# EasyEDA Pro project ProProject_Driver_STM32F031_2023-10-07.epro, schematic Schematic1_3
Create Date: 2023-06-01; Page Name: P1; Project Name: Board1_2; Schematic Name: Schematic1_2; Update Date: 2023-06-05; Company: 嘉立创EDA; Page Size: A4; Version: V1.0
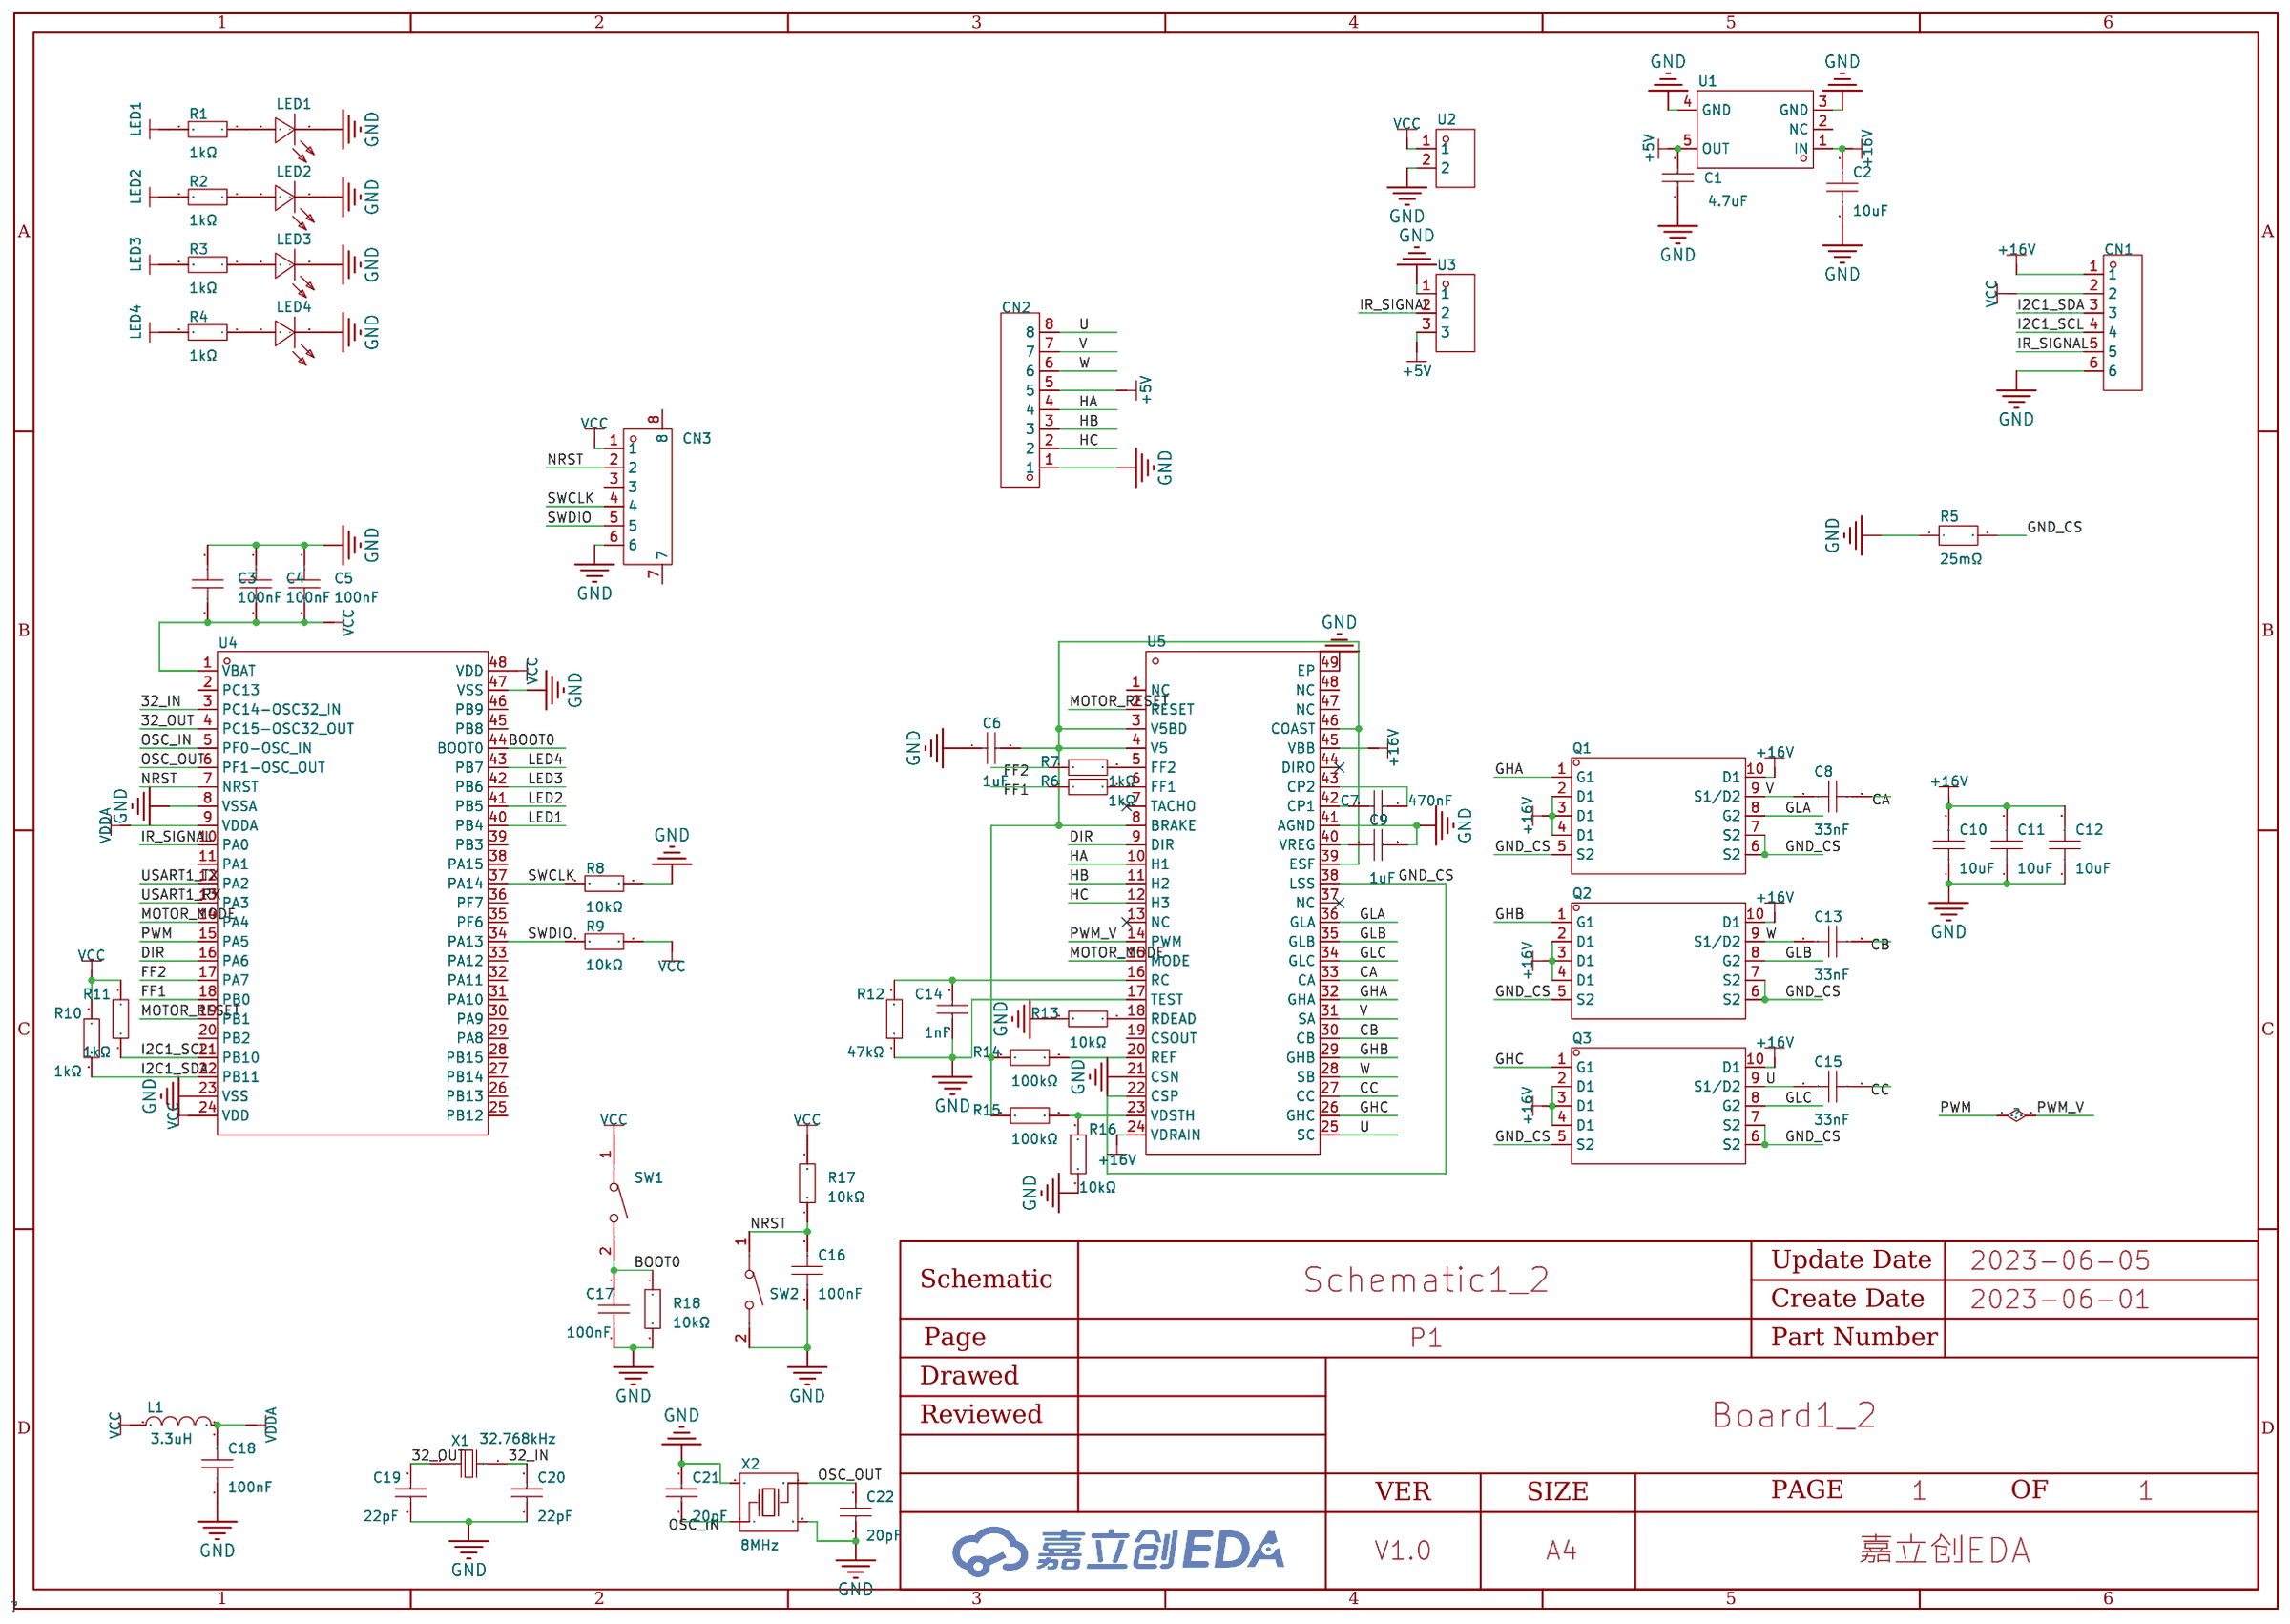
[diagram p1: schematic sheet]

## Parts
C1  4.7uF  [C0603]
C2  10uF  [C0603]
C3  100nF  [C0603]
C4  100nF  [C0603]
C5  100nF  [C0603]
C6  1uF  [C0603]
C7  470nF  [C0603]
C8  33nF  [C0603]
C9  1uF  [C0603]
C10  10uF  [C1206]
C11  10uF  [C1206]
C12  10uF  [C1206]
C13  33nF  [C0603]
C14  1nF  [C0603]
C15  33nF  [C0603]
C16  100nF  [C0603]
C17  100nF  [C0603]
C18  100nF  [C0603]
C19  22pF  [C0603]
C20  22pF  [C0603]
C21  20pF  [C0603]
C22  20pF  [C0603]
CN1  HC-5264-6A  [CONN-TH_6P-P2.50_HCTL_HC-5264-6A]
CN2  HC-5264-8AW  [CONN-TH_8P-P2.50_HC-5264-8AW]
CN3  532610671  [CONN-SMD_6P-P1.25_53261-0671]
L1  3.3uH  [L0603]
LED1  SZYY0805B  [LED0805-R-RD_BLUE]
LED2  SZYY0805B  [LED0805-R-RD_BLUE]
LED3  SZYY0805B  [LED0805-R-RD_BLUE]
LED4  SZYY0805B  [LED0805-R-RD_BLUE]
Q1  DMT3009LDT-7  [V-DFN3030-8K_L3.0-W3.0-P0.65-BL]
Q2  DMT3009LDT-7  [V-DFN3030-8K_L3.0-W3.0-P0.65-BL]
Q3  DMT3009LDT-7  [V-DFN3030-8K_L3.0-W3.0-P0.65-BL]
R1  1kΩ  [R0603]
R2  1kΩ  [R0603]
R3  1kΩ  [R0603]
R4  1kΩ  [R0603]
R5  25mΩ  [RES-SMD_L6.4-W3.2-R2512]
R6  1kΩ  [R0603]
R7  1kΩ  [R0603]
R8  10kΩ  [R0603]
R9  10kΩ  [R0603]
R10  1kΩ  [R0603]
R11  1kΩ  [R0603]
R12  47kΩ  [R0603]
R13  10kΩ  [R0603]
R14  100kΩ  [R0603]
R15  100kΩ  [R0603]
R16  10kΩ  [R0603]
R17  10kΩ  [R0603]
R18  10kΩ  [R0603]
SW1  TS-1088-AR02016  [SW-SMD_L3.9-W3.0-P4.45]
SW2  TS-1088-AR02016  [SW-SMD_L3.9-W3.0-P4.45]
U1  TPS7B6950DBVR  [SOT-23-5_L3.0-W1.7-P0.95-LS2.8-BL]
U2  DW200R-11-02-43  [HDR-TH_2P-P2.00-V-F]
U3  PM200-1-03-Z-4.3  [HDR-TH_3P-P2.00-V-F-A]
U4  STM32F031C6T6TR  [LQFP-48_L7.0-W7.0-P0.50-LS9.0-TL]
U5  A3930KJPTR-T  [LQFP-48_L7.0-W7.0-P0.50-LS9.0-BL-EP]
X1  32.768kHz  [CRYSTAL-SMD_L3.2-W1.5-1]
X2  8MHz  [OSC-SMD_4P-L3.2-W2.5-BL]

## Library data of the parts
C1 = CL10A475KO8NNNC: 温度系数:X5R;精度:±10%;容值:4.7uF;额定电压:16V;; LCSC Part Name: 4.7uF ±10% 16V; Supplier Part: C19666; Manufacturer: SAMSUNG(三星); Supplier Footprint: 0603; JLCPCB Part Class: Basic Part; Datasheet: https://atta.szlcsc.com/upload/public/pdf/source/20160103/1457707703134.pdf; Supplier: LCSC; Temperature Coefficient: X5R; Tolerance: ±10%; Voltage Rated: 16V
C2 = GRM188C80G106KE47D: 容值:10uF;精度:±10%;额定电压:-;材质(温度系数):-;; LCSC Part Name: 10uF ±10%; Supplier Part: C710916; Manufacturer: muRata(村田); Supplier Footprint: 0603; JLCPCB Part Class: Extended Part; Datasheet: https://atta.szlcsc.com/upload/public/pdf/source/20210205/C710916_8901BCC8D8E6CC54F2C999D22152DEF1.pdf; Supplier: LCSC; Tolerance: ±10%
C3-C5 C16-C18 = TCC0603X7R104K500CT: 容值:100nF;精度:±10%;额定电压:50V;材质(温度系数):X7R;; LCSC Part Name: 100nF ±10% 50V; Supplier Part: C282519; Manufacturer: CCTC(三环); Supplier Footprint: 0603; JLCPCB Part Class: Extended Part; Datasheet: https://atta.szlcsc.com/upload/public/pdf/source/20180917/C282519_8CE721FA29EE85BB321020B63D7877A0.pdf; Supplier: LCSC; Tolerance: ±10%; Voltage Rated: 50V; Temperature Coefficient: X7R
C6 C9 = CL10A105KB8NNNC: 容值:1uF;精度:±10%;额定电压:50V;材质(温度系数):X5R;; LCSC Part Name: 1uF ±10% 50V; Supplier Part: C15849; Manufacturer: SAMSUNG(三星); Supplier Footprint: 0603; JLCPCB Part Class: Basic Part; Datasheet: https://atta.szlcsc.com/upload/public/pdf/source/20160103/1457707679084.pdf; Supplier: LCSC; Tolerance: ±10%; Voltage Rated: 50V; Temperature Coefficient: X5R
C7 = 0603B474K500NT: 容值:470nF;精度:±10%;额定电压:50V;材质(温度系数):X7R;; LCSC Part Name: 470nF ±10% 50V; Supplier Part: C77572; Manufacturer: FH(风华); Supplier Footprint: 0603; JLCPCB Part Class: Extended Part; Datasheet: https://atta.szlcsc.com/upload/public/pdf/source/20170923/C77572_1506149543326988941.pdf; Supplier: LCSC; Tolerance: ±10%; Voltage Rated: 50V; Temperature Coefficient: X7R
C8 C13 C15 = CL10B333JB8NNNC: 容值:33nF;精度:±5%;额定电压:50V;材质(温度系数):X7R;; LCSC Part Name: 33nF ±5% 50V; Supplier Part: C377760; Manufacturer: SAMSUNG(三星); Supplier Footprint: 0603; JLCPCB Part Class: Extended Part; Datasheet: https://atta.szlcsc.com/upload/public/pdf/source/20190322/C377760_4801615B1239BA7CCDCF452430F04471.pdf; Supplier: LCSC; Tolerance: ±5%; Voltage Rated: 50V; Temperature Coefficient: X7R
C10-C12 = GRM31CB31H106KA12L: 容值:10uF;精度:±10%;额定电压:50V;材质(温度系数):B;; LCSC Part Name: 10uF ±10% 50V; Supplier Part: C521234; Manufacturer: muRata(村田); Supplier Footprint: 1206; JLCPCB Part Class: Extended Part; Datasheet: https://atta.szlcsc.com/upload/public/pdf/source/20200424/C521234_36A2086CC2FC59561FA20FEB9FAD436A.pdf; Supplier: LCSC; Tolerance: ±10%; Voltage Rated: 50V; Temperature Coefficient: B
C14 = CL10B102KB8NNNC: 容值:1nF;精度:±10%;额定电压:50V;材质(温度系数):X7R;; LCSC Part Name: 1nF ±10% 50V; Supplier Part: C1588; Manufacturer: SAMSUNG(三星); Supplier Footprint: 0603; JLCPCB Part Class: Basic Part; Datasheet: https://atta.szlcsc.com/upload/public/pdf/source/20160103/1457707679526.pdf; Supplier: LCSC; Tolerance: ±10%; Voltage Rated: 50V; Temperature Coefficient: X7R
C19 C20 = CL10C220JB8NNNC: 容值:22pF;精度:±5%;额定电压:50V;材质(温度系数):C0G;; LCSC Part Name: 22pF ±5% 50V; Supplier Part: C1653; Manufacturer: SAMSUNG(三星); Supplier Footprint: 0603; JLCPCB Part Class: Basic Part; Datasheet: https://atta.szlcsc.com/upload/public/pdf/source/20160103/1457707687317.pdf; Supplier: LCSC; Tolerance: ±5%; Voltage Rated: 50V; Temperature Coefficient: C0G
C21 C22 = CL10C200JB8NNNC: 容值:20pF;精度:±5%;额定电压:50V;材质(温度系数):C0G;; LCSC Part Name: 20pF ±5% 50V; Supplier Part: C1648; Manufacturer: SAMSUNG(三星); Supplier Footprint: 0603; JLCPCB Part Class: Basic Part; Datasheet: https://atta.szlcsc.com/upload/public/pdf/source/20160103/1457707686863.pdf; Supplier: LCSC; Tolerance: ±5%; Voltage Rated: 50V; Temperature Coefficient: C0G
CN1 = HC-5264-6A: 参考系列:-;间距:2.5mm;插针结构:1x6P;排数:1;每排PIN数:6;行距:-;公母:公型插针;安装方式:直插;额定电流:3A;工作温度范围:-25℃~+85℃;; LCSC Part Name: 2.5mm 1x6P 直插; Supplier Part: C2845818; Manufacturer: HCTL(华灿天禄); Supplier Footprint: 直插,P=2.5mm; JLCPCB Part Class: Extended Part; Datasheet: https://atta.szlcsc.com/upload/public/pdf/source/20210728/C2845814_DFD3D2538445536899F79025E2B03A5C.pdf; Supplier: LCSC; Pitch: 2.5mm; Pins Structure: 1x6P; Number of Rows: 1; Number of PINs Per Row: 6; Gender: 公型插针; Mounting Style: 直插; Current Rating (Max): 3A; Operating Temperature Range: -25℃~+85℃
CN2 = HC-5264-8AW: 参考系列:-;间距:2.5mm;插针结构:1x8P;排数:1;每排PIN数:8;行距:-;公母:公型插针;安装方式:弯插;额定电流:3A;工作温度范围:-25℃~+85℃;; LCSC Part Name: 2.5mm 1x8P 弯插; Supplier Part: C2845831; Manufacturer: HCTL(华灿天禄); Supplier Footprint: 弯插,P=2.5mm; JLCPCB Part Class: Extended Part; Datasheet: https://atta.szlcsc.com/upload/public/pdf/source/20210728/C2845825_8A371A7E0B3DBB1209B365938FCC7945.pdf; Supplier: LCSC; Pitch: 2.5mm; Pins Structure: 1x8P; Number of Rows: 1; Number of PINs Per Row: 8; Gender: 公型插针; Mounting Style: 弯插; Current Rating (Max): 3A; Operating Temperature Range: -25℃~+85℃
CN3 = 532610671: 参考系列:-;间距:1.25mm;插针结构:1x6P;排数:1;每排PIN数:6;行距:-;安装方式:-;触头材质:青铜;; LCSC Part Name: 1.25mm 1x6P; Supplier Part: C99277; Manufacturer: MOLEX; JLCPCB Part Class: Extended Part; Datasheet: https://atta.szlcsc.com/upload/public/pdf/source/20180713/C99277_7A4A98FEF11A2209B5FFC17F14BF7E54.pdf; Supplier: LCSC; Pitch: 1.25mm; Pins Structure: 1x6P; Number of Rows: 1; Number of PINs Per Row: 6; Contact Material: 青铜
L1 = CMI160808U3R3KT: 额定电流:15mA;电感值:3.3uH;精度:±10%;饱和电流(Isat):-;直流电阻(DCR):1Ω;; LCSC Part Name: 3.3uH ±10% 15mA 1Ω; Supplier Part: C139209; Manufacturer: FH(风华); Supplier Footprint: 0603; JLCPCB Part Class: Extended Part; Datasheet: https://atta.szlcsc.com/upload/public/pdf/source/20180412/C139209_76E8EB9664C870BAE46EFE11DEB22A4C.pdf; Supplier: LCSC; Rated Current: 15mA; Tolerance: ±10%; DC Resistance (DCR): 1Ω
LED1-LED4 = SZYY0805B: 发光颜色:蓝灯;二极管配置:-;透镜颜色:无色透明;主波长:460nm~475nm;峰值波长:469nm;色温:-;光通量(25时):-;测试电流:5mA;正向电压(VF):3.1V;发光强度:100mcd;功率:100mW;发光角度:120°;安装方式:-;工作温度:-40~+85;; LCSC Part Name: 蓝灯; Supplier Part: C434433; Manufacturer: yongyu(永裕光电); Supplier Footprint: 0805; JLCPCB Part Class: Extended Part; Datasheet: https://atta.szlcsc.com/upload/public/pdf/source/20191204/C434433_0B90CAB876449C52BDD12D5E48F83BBD.pdf; Supplier: LCSC; Emitted Color: 蓝灯; Lens Color: 无色透明; Dominant Wavelength: 460nm~475nm; Peak Wavelength: 469nm; Forward Current: 5mA; Forward Voltage (VF): 3.1V; Luminous Intensity: 100mcd; Power Dissipation: 100mW; Viewing Angle: 120°; Operating Temperature: -40~+85
Q1-Q3 = DMT3009LDT-7: 类型:双N沟道(半桥);漏源电压(Vdss):30V;连续漏极电流(Id):30A;功率(Pd):1.2W;导通电阻(RDS(on)@Vgs,Id):11.1mΩ@10V,14.4A;阈值电压(Vgs(th)@Id):3V@250uA;; LCSC Part Name: 双N沟道(半桥) 30V 30A; Supplier Part: C155503; Manufacturer: DIODES(美台); Supplier Footprint: V-DFN3030-8; JLCPCB Part Class: Extended Part; Datasheet: https://atta.szlcsc.com/upload/public/pdf/source/20181206/C155503_C9E5F849506B8E5BF51429E256EC4CEC.pdf; Supplier: LCSC; Type: 双N沟道(半桥); Drain Source Voltage (Vdss): 30V; Continuous Drain Current (Id): 30A; Power Dissipation (Pd): 1.2W; Drain Source On Resistance (RDS(on)@Vgs,Id): 11.1mΩ@10V,14.4A; Gate Threshold Voltage (Vgs(th)@Id): 3V@250uA
R1-R4 R6 R7 R10 R11 = 0603WAF1001T5E: 电阻类型:厚膜电阻;阻值:1kΩ;精度:±1%;功率:100mW;温度系数:±100ppm/℃;最大工作电压:75V;工作温度范围:-55℃~+155℃;; LCSC Part Name: 1kΩ ±1% 100mW; Supplier Part: C21190; Manufacturer: UNI-ROYAL(厚声); Supplier Footprint: 0603; JLCPCB Part Class: Basic Part; Datasheet: https://atta.szlcsc.com/upload/public/pdf/source/20200306/C422600_1E6D84923E4A46A82E41ADD87F860B5C.pdf; Supplier: LCSC; Type: 厚膜电阻; Tolerance: ±1%; Power(Watts): 100mW; Temperature Coefficient: ±100ppm/℃; Overload Voltage (Max): 75V; Operating Temperature Range: -55℃~+155℃
R5 = HoJLR2512-3W-25mR-1%: 阻值:25mΩ;精度:±1%;功率:3W;温度系数:±50ppm/℃;工作温度范围:-50℃~+170℃;; LCSC Part Name: 25mΩ ±1% 3W; Supplier Part: C2903480; Manufacturer: Milliohm(毫欧); Supplier Footprint: 2512; JLCPCB Part Class: Extended Part; Datasheet: https://atta.szlcsc.com/upload/public/pdf/source/20211009/7525CABAB363C979E942C1DD41F1FEF0.pdf; Supplier: LCSC; Tolerance: ±1%; Power(Watts): 3W; Temperature Coefficient: ±50ppm/℃; Operating Temperature Range: -50℃~+170℃
R8 R9 R13 R16-R18 = RC0603FR-0710KL: 电阻类型:厚膜电阻;阻值:10kΩ;精度:±1%;功率:100mW;温度系数:±100ppm/℃;最大工作电压:75V;工作温度范围:-55℃~+155℃;; LCSC Part Name: 10kΩ ±1% 100mW; Supplier Part: C98220; Manufacturer: YAGEO(国巨); Supplier Footprint: 0603; JLCPCB Part Class: Extended Part; Datasheet: https://atta.szlcsc.com/upload/public/pdf/source/20170522/1495423494387.pdf; Supplier: LCSC; Type: 厚膜电阻; Tolerance: ±1%; Power(Watts): 100mW; Temperature Coefficient: ±100ppm/℃; Overload Voltage (Max): 75V; Operating Temperature Range: -55℃~+155℃
R12 = 0603WAF4702T5E: 精度:±1%;温度系数:±100ppm/℃;功率:1/10W;阻值:47kΩ;最大工作电压:75V;工作温度范围:-55℃~+155℃;; LCSC Part Name: 47KΩ ±1%; Supplier Part: C25819; Manufacturer: UNI-ROYAL(厚声); Supplier Footprint: 0603; JLCPCB Part Class: Basic Part; Datasheet: https://atta.szlcsc.com/upload/public/pdf/source/20170920/C25819_1505901557326983389.pdf; Supplier: LCSC; Tolerance: ±1%; Temperature Coefficient: ±100ppm/℃; Power(Watts): 1/10W; Overload Voltage (Max): 75V; Operating Temperature Range: -55℃~+155℃
R14 R15 = 0603WAF1003T5E: 电阻类型:厚膜电阻;阻值:100kΩ;精度:±1%;功率:100mW;温度系数:±100ppm/℃;最大工作电压:75V;工作温度范围:-55℃~+155℃;; LCSC Part Name: 100kΩ ±1% 100mW; Supplier Part: C25803; Manufacturer: UNI-ROYAL(厚声); Supplier Footprint: 0603; JLCPCB Part Class: Basic Part; Datasheet: https://atta.szlcsc.com/upload/public/pdf/source/20200306/C422600_1E6D84923E4A46A82E41ADD87F860B5C.pdf; Supplier: LCSC; Type: 厚膜电阻; Tolerance: ±1%; Power(Watts): 100mW; Temperature Coefficient: ±100ppm/℃; Overload Voltage (Max): 75V; Operating Temperature Range: -55℃~+155℃
SW1 SW2 = TS-1088-AR02016: 触点电流:50mA;额定电压(DC):12V;绝缘电阻:100MΩ;电路结构:单刀单掷;安装方式:立贴;按钮形状:圆形按钮;按钮/盖帽颜色:黑色;作用力:160gf@±50gf;机械寿命:100000;工作温度:-30℃~+80℃;引脚样式:SMD接片;开关长度:4mm;开关宽度:3mm;开关高度:2mm;带支架:否;; LCSC Part Name: 3x4x2.0 160gf 贴片无柱轻触开关; Supplier Part: C720477; Manufacturer: XUNPU(讯普); Supplier Footprint: SMD; JLCPCB Part Class: Extended Part; Datasheet: https://atta.szlcsc.com/upload/public/pdf/source/20200810/C720475_60D09DD6C54279ADDB2DC25100F1CC11.pdf; Supplier: LCSC; Contact Current: 50mA; Voltage Rating (DC): 12V; Insulation Resistance: 100MΩ; Circuit: 单刀单掷; Mounting Style: 立贴; Actuator Style: 圆形按钮; Actuator/Cap Color: 黑色; Operating Force: 160gf@±50gf; Mechanical Life: 100000; Operating Temperature: -30℃~+80℃; Pin Style: SMD接片; Switch Length: 4mm; Switch Width: 3mm; Switch Height: 2mm; Strike Gundam: 否
U1 = TPS7B6950DBVR: 输出类型:固定;输出极性:正;输出通道数:1;最大输入电压:40V;输出电压:5V;压差:800mV@(100mA);输出电流:150mA;电源纹波抑制比(PSRR):60dB@(100Hz);; LCSC Part Name: 正 Vin=40V Vout=5V 150mA 60dB@(100Hz); Supplier Part: C174327; Manufacturer: TI(德州仪器); Supplier Footprint: SOT-23-5; JLCPCB Part Class: Extended Part; Datasheet: https://atta.szlcsc.com/upload/public/pdf/source/20180202/C174327_15175649229381336371.pdf; Supplier: LCSC; Output Type: 固定; Output Polarity: 正; Number of Outputs: 1; Maximum Input Voltage: 40V; Output Voltage: 5V; Dropout Voltage: 800mV@(100mA); Output Current: 150mA; Power Supply Rejection Ratio (PSRR): 60dB@(100Hz)
U2 = DW200R-11-02-43: 排数:单排;总孔位数:2;间距:2mm;插孔结构:1x2P;行距:-;安装类型:直插;圆孔/方孔:方孔;额定电流:1.5A;额定电压:-;插孔方向:顶部;塑高:4.3mm;工作温度范围:-;; LCSC Part Name: 2mm 1x2P; Supplier Part: C2935966; Manufacturer: DEALON(德艺隆); Supplier Footprint: 直插,P=2mm; JLCPCB Part Class: Extended Part; Datasheet: https://atta.szlcsc.com/upload/public/pdf/source/20211231/E8E7D3551DA226B9682C58719323E9C2.pdf; Supplier: LCSC; Number of Rows: 单排; Number of Holes: 2; Pitch: 2mm; Holes Structure: 1x2P; Mounting Type: 直插; Circular Hole / Square Hole: 方孔; Current Rating (Max): 1.5A; Holes Direction: 顶部; Insulation Height: 4.3mm
U3 = PM200-1-03-Z-4.3: 排数:单排;总孔位数:3;间距:2mm;插孔结构:1x3P;行距:-;安装类型:直插;圆孔/方孔:方孔;额定电流:1.5A;额定电压:-;插孔方向:顶部;塑高:4.3mm;工作温度范围:-40℃~+105℃;; LCSC Part Name: 2mm 1x3P; Supplier Part: C2906033; Manufacturer: HCTL(华灿天禄); Supplier Footprint: 插件,P=2mm; JLCPCB Part Class: Extended Part; Datasheet: https://atta.szlcsc.com/upload/public/pdf/source/20211020/DC9111BC21DDF9F66FB724A89731F030.pdf; Supplier: LCSC; Number of Rows: 单排; Number of Holes: 3; Pitch: 2mm; Holes Structure: 1x3P; Mounting Type: 直插; Circular Hole / Square Hole: 方孔; Current Rating (Max): 1.5A; Holes Direction: 顶部; Insulation Height: 4.3mm; Operating Temperature Range: -40℃~+105℃
U4 = STM32F031C6T6TR: CPU内核:ARM Cortex-M0;CPU最大主频:48MHz;工作电压范围:2V~3.6V;程序存储容量:32KB;RAM总容量:4KB;EEPROM/数据 FLASH容量:32KB;GPIO端口数量:39;ADC(位数):12bit;DAC(位数):-;(E)PWM(位数):-;外设/功能:DMA；看门狗；PWM;内部振荡器:有;工作温度范围:-40℃~+85℃;; LCSC Part Name: ARM Cortex-M0 48MHz; Supplier Part: C329281; Manufacturer: ST(意法半导体); Supplier Footprint: LQFP-48(7x7); JLCPCB Part Class: Extended Part; Datasheet: https://atta.szlcsc.com/upload/public/pdf/source/20200115/C329281_BA1E970E2AF70B7E7E25D04A5194356F.pdf; Supplier: LCSC; CPU Core: ARM Cortex-M0; CPU Maximum Speed: 48MHz; Operating Voltage Range: 2V~3.6V; Program Storage Size: 32KB; Program Memory Type: FLASH; RAM Size: 4KB; EEPROM: 32KB; GPIO Ports Number: 39; ADC (Bit): 12bit; Peripheral/Function: DMA；看门狗；PWM; Internal Oscillator: 有; Operating Temperature Range: -40℃~+85℃
U5 = A3930KJPTR-T: 电源电压:5.5V~50V;输出电流:-;接口:并行;; LCSC Part Name: 电机驱动芯片; Supplier Part: C459252; Manufacturer: ALLEGRO(美国埃戈罗); Supplier Footprint: LQFP-48(7x7); JLCPCB Part Class: Extended Part; Datasheet: https://atta.szlcsc.com/upload/public/pdf/source/20200518/C459252_E214869B5841466FF326F30C716B8FBE.pdf; Supplier: LCSC; Type: 无刷直流BLDC; Supply Voltage: 5.5V~50V; Interface: 并行; Operating Temperature: -40℃~+150℃@(Ta)
X1 = FC31M2-32.768-NTLLLDT: 晶振类型:贴片无源晶振;频率:32.768kHz;频率公差:±20ppm;频率稳定度:±20ppm;负载电容:12.5pF;等效串联电阻(ESR):50kΩ;工作温度:-40℃~+85℃;; LCSC Part Name: 32.768kHz ±20ppm 12.5pF; Supplier Part: C2842180; Manufacturer: HCI(杭晶); Supplier Footprint: SMD3215-2P; JLCPCB Part Class: Extended Part; Datasheet: https://atta.szlcsc.com/upload/public/pdf/source/20220525/2E044CF849361D91E29045F083201687.pdf; Supplier: LCSC; Crystal Type: 贴片无源晶振; Frequency Tolerance: ±20ppm; Frequency Stability: ±20ppm; Load Capacitance: 12.5pF; Equivalent Series Resistance (ESR): 50kΩ; Operating Temperature: -40℃~+85℃
X2 = TAXM8M4RDBCCT2T: 晶振类型:贴片无源晶振;频率:8MHz;频率公差:±10ppm;频率稳定度:±15ppm;负载电容:10pF;等效串联电阻(ESR):250Ω;工作温度:-;; LCSC Part Name: 8MHz ±10ppm 10pF; Supplier Part: C400090; Manufacturer: TAE(雅晶鑫); Supplier Footprint: SMD3225-4P; JLCPCB Part Class: Extended Part; Datasheet: https://atta.szlcsc.com/upload/public/pdf/source/20190626/C400090_CF95B89E745AFE4EF2E392EF8AC009D6.pdf; Supplier: LCSC; Crystal Type: 贴片无源晶振; Frequency Tolerance: ±10ppm; Frequency Stability: ±15ppm; Load Capacitance: 10pF; Equivalent Series Resistance (ESR): 250Ω

## Nets
+5V: C1.2 CN2.5 U1.5(OUT) U3.3
+16V: C2.2 C10.2 C11.2 C12.2 CN1.1 Q1.2(D1) Q1.3(D1) Q1.4(D1) Q1.10(D1) Q2.2(D1) Q2.3(D1) Q2.4(D1) Q2.10(D1) Q3.2(D1) Q3.3(D1) Q3.4(D1) Q3.10(D1) U1.1(IN) U5.24(VDRAIN) U5.45(VBB)
GND: C1.1 C2.1 C3.1 C4.1 C5.1 C6.1 C9.2 C10.1 C11.1 C12.1 C14.1 C16.1 C17.2 C18.1 C19.1 C20.1 C21.1 C22.2 CN1.6 CN2.1 CN3.6 LED1.2(-) LED2.2(-) LED3.2(-) LED4.2(-) R5.1 R8.1 R12.1 R13.2 R16.1 R18.2 SW2.2 U1.3(GND) U1.4(GND) U2.2 U3.1 U4.8(VSSA) U4.23(VSS) U4.47(VSS) U5.17(TEST) U5.21(CSN) U5.41(AGND) U5.49(EP) X2.2 X2.4
GND_CS: Q1.5(S2) Q1.6(S2) Q1.7(S2) Q2.5(S2) Q2.6(S2) Q2.7(S2) Q3.5(S2) Q3.6(S2) Q3.7(S2) R5.2 U5.22(CSP) U5.38(LSS)
VCC: C3.2 C4.2 C5.2 CN1.2 CN3.1 L1.1 R9.1 R10.1 R11.1 R17.2 SW1.1 U2.1 U4.1(VBAT) U4.24(VDD) U4.48(VDD)
VDDA: C18.2 L1.2 U4.9(VDDA)
32_IN: C20.2 U4.3(PC14-OSC32_IN) X1.2
32_OUT: C19.2 U4.4(PC15-OSC32_OUT) X1.1
BOOT0: C17.1 R18.1 SW1.2 U4.44(BOOT0)
CA: C8.1 U5.33(CA)
CB: C13.1 U5.30(CB)
CC: C15.1 U5.27(CC)
DIR: U4.16(PA6) U5.9(DIR)
FF1: R6.1 U4.18(PB0)
FF2: R7.1 U4.17(PA7)
GHA: Q1.1(G1) U5.32(GHA)
GHB: Q2.1(G1) U5.29(GHB)
GHC: Q3.1(G1) U5.26(GHC)
GLA: Q1.8(G2) U5.36(GLA)
GLB: Q2.8(G2) U5.35(GLB)
GLC: Q3.8(G2) U5.34(GLC)
HA: CN2.4 U5.10(H1)
HB: CN2.3 U5.11(H2)
HC: CN2.2 U5.12(H3)
I2C1_SCL: CN1.4 R11.2 U4.21(PB10)
I2C1_SDA: CN1.3 R10.2 U4.22(PB11)
IR_SIGNAL: CN1.5 U3.2 U4.10(PA0)
LED1: R1.2 U4.40(PB4)
LED2: R2.2 U4.41(PB5)
LED3: R3.2 U4.42(PB6)
LED4: R4.2 U4.43(PB7)
MOTOR_MODE: U4.14(PA4) U5.15(MODE)
MOTOR_RESET: U4.19(PB1) U5.2(RESET)
NRST: C16.2 CN3.2 R17.1 SW2.1 U4.7(NRST)
OSC_IN: C21.2 U4.5(PF0-OSC_IN) X2.1
OSC_OUT: C22.1 U4.6(PF1-OSC_OUT) X2.3
PWM: U4.15(PA5) U5.14(PWM)
SWCLK: CN3.4 R8.2 U4.37(PA14)
SWDIO: CN3.5 R9.2 U4.34(PA13)
U: C15.2 CN2.8 Q3.9(S1/D2) U5.25(SC)
USART1_RX: U4.13(PA3)
USART1_TX: U4.12(PA2)
V: C8.2 CN2.7 Q1.9(S1/D2) U5.31(SA)
W: C13.2 CN2.6 Q2.9(S1/D2) U5.28(SB)
$1N6930: C7.2 U5.43(CP2)
$1N6936: C9.1 U5.40(VREG)
$1N6937: C7.1 U5.42(CP1)
$1N6938: R14.2 U5.20(REF)
$1N6939: C14.2 R12.2 U5.16(RC)
$1N6940: R15.2 R16.2 U5.23(VDSTH)
$1N6942: R13.1 U5.18(RDEAD)
$1N6958: C6.2 R14.1 R15.1 U5.3(V5BD) U5.4(V5) U5.8(BRAKE) U5.39(ESF) U5.46(COAST)
$1N6995: LED1.1(+) R1.1
$1N6998: LED2.1(+) R2.1
$1N7001: LED3.1(+) R3.1
$1N7004: LED4.1(+) R4.1
$1N51447: R6.2 U5.6(FF1)
$1N51449: R7.2 U5.5(FF2)

Not connected (* = marked no-connect by the designer): CN3 3 7 8; U1 2(NC); U4 2(PC13) 11(PA1) 20(PB2) 25(PB12) 26(PB13) 27(PB14) 28(PB15) 29(PA8) 30(PA9) 31(PA10) 32(PA11) 33(PA12) 35(PF6) 36(PF7) 38(PA15) 39(PB3) 45(PB8) 46(PB9); U5 1(NC) 7(TACHO)* 13(NC)* 19(CSOUT) 37(NC)* 44(DIRO)* 47(NC) 48(NC)
